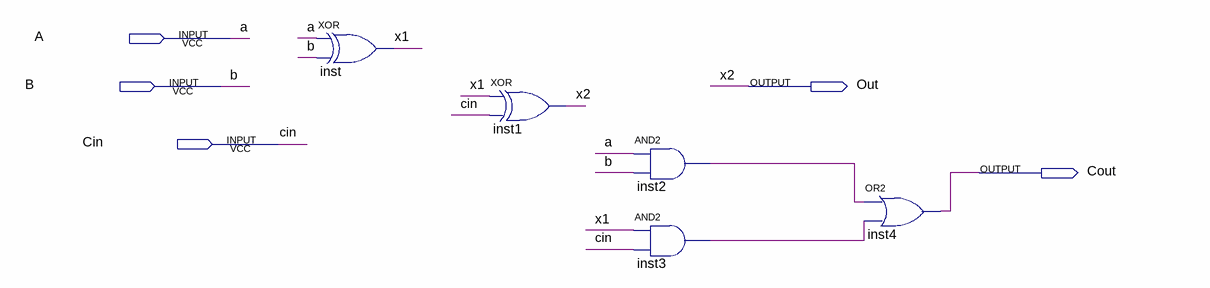
[diagram p0: schematic sheet]
// Quartus schematic FullAdder1bit.bdf as structural Verilog: 5 symbols, 5 pins
module FullAdder1bit (
  input  A,
  input  B,
  input  Cin,
  output Out,
  output Cout
);

  wire inst2_out, inst3_out, x1;

  xor inst (x1, A, B);
  xor inst1 (Out, x1, Cin);
  and inst2 (inst2_out, A, B);
  and inst3 (inst3_out, x1, Cin);
  or inst4 (Cout, inst2_out, inst3_out);

  // Other names for the same wires on the sheet: x2 = Out
endmodule
